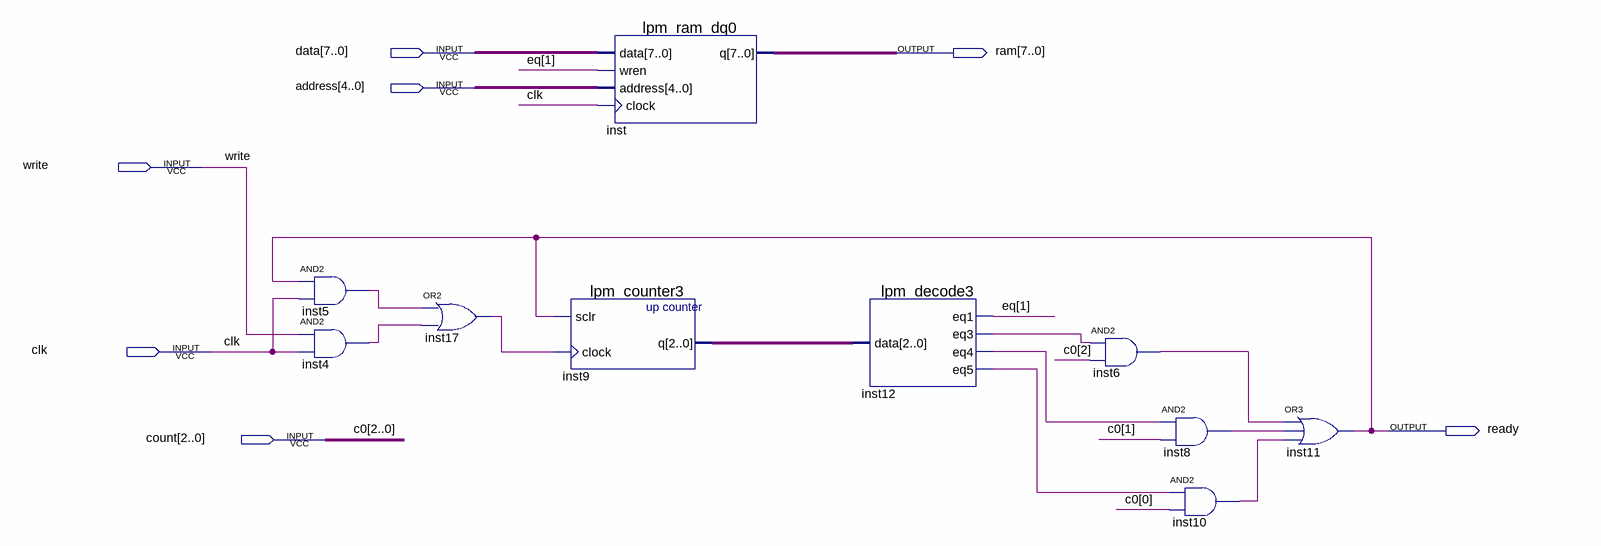
[diagram p0: schematic sheet]
// Quartus schematic bus_slave.bdf as structural Verilog: 10 symbols, 7 pins
module bus_slave (
  input  [7:0] data,
  input  [4:0] address,
  input  write,
  input  clk,
  input  [2:0] count,
  output [7:0] ram,
  output ready
);

  wire inst4_out, inst5_out, inst6_out, inst8_out, inst10_out, inst12_eq3, inst12_eq4, inst12_eq5, inst17_out;
  wire [1:1] eq;
  wire [2:0] inst9_q;

  and inst5 (inst5_out, ready, clk);
  and inst4 (inst4_out, write, clk);
  or inst17 (inst17_out, inst5_out, inst4_out);
  lpm_counter3 inst9 (.sclr(ready), .clock(inst17_out), .q(inst9_q));
  lpm_ram_dq0 inst (.data(data), .wren(eq[1]), .address(address), .clock(clk), .q(ram));
  lpm_decode3 inst12 (.data(inst9_q), .eq1(eq[1]), .eq3(inst12_eq3), .eq4(inst12_eq4), .eq5(inst12_eq5));
  and inst6 (inst6_out, inst12_eq3, count[2]);
  and inst8 (inst8_out, inst12_eq4, count[1]);
  and inst10 (inst10_out, inst12_eq5, count[0]);
  or inst11 (ready, inst6_out, inst8_out, inst10_out);

  // Other names for the same wires on the sheet: c0[2:0] = count
endmodule
